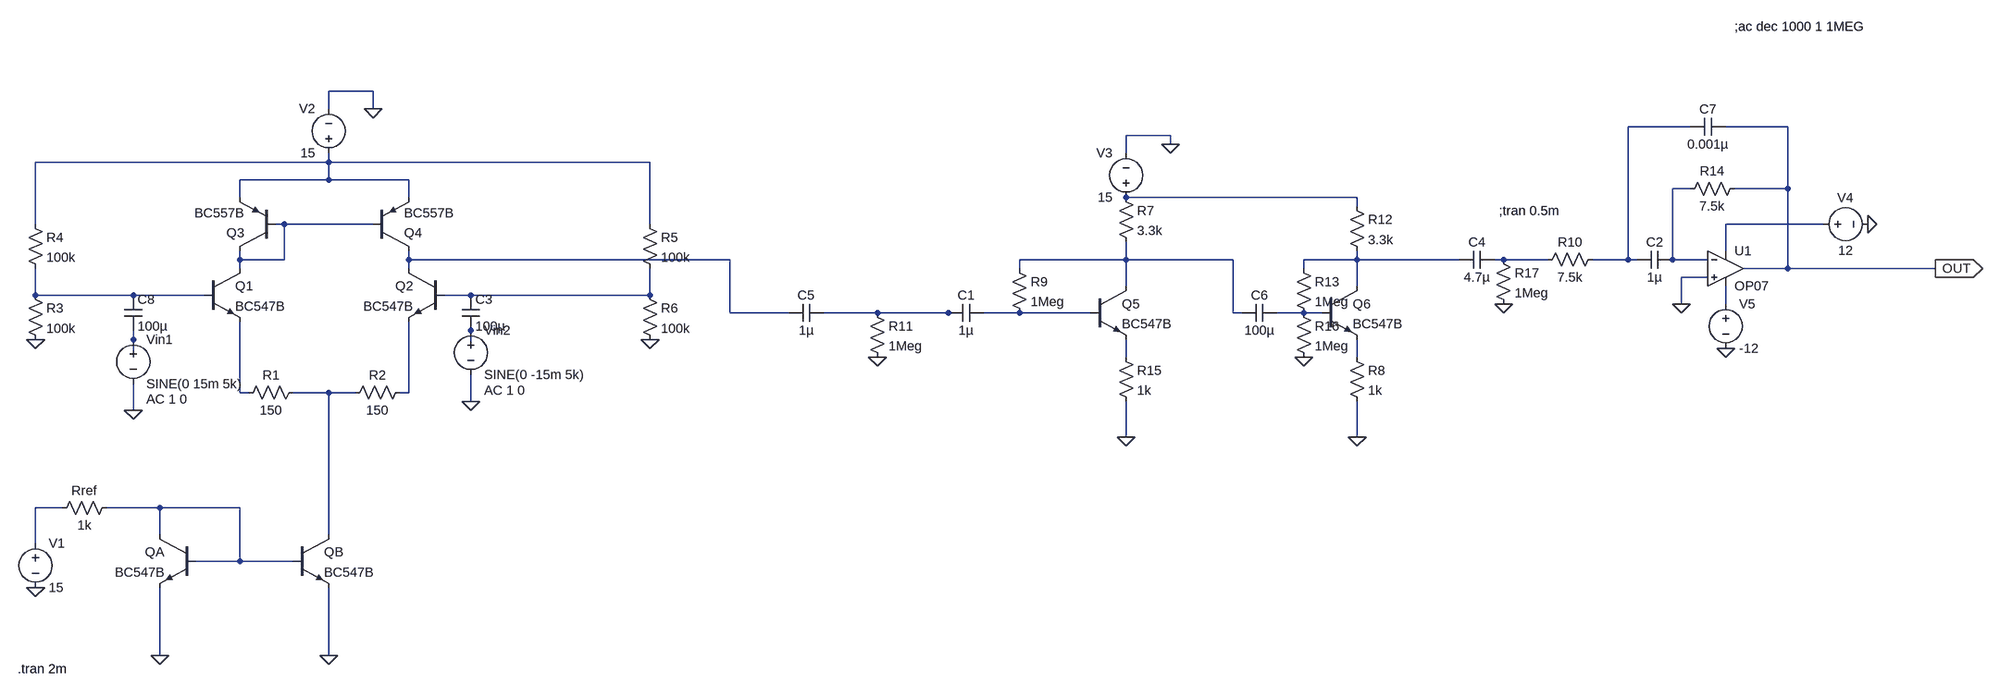
[diagram p0: schematic made by rohan.asc]
made by rohan.asc, the LTspice schematic file:
Version 4
SHEET 1 3628 1044
WIRE 240 -240 160 -240
WIRE 160 -208 160 -240
WIRE 240 -208 240 -240
WIRE 2720 -176 2608 -176
WIRE 2896 -176 2784 -176
WIRE 1776 -160 1696 -160
WIRE 1776 -144 1776 -160
WIRE 1696 -128 1696 -160
WIRE 160 -112 160 -128
WIRE 160 -112 -368 -112
WIRE 752 -112 160 -112
WIRE 160 -80 160 -112
WIRE 160 -80 0 -80
WIRE 304 -80 160 -80
WIRE 2720 -64 2688 -64
WIRE 2896 -64 2896 -176
WIRE 2896 -64 2800 -64
WIRE 0 -48 0 -80
WIRE 304 -48 304 -80
WIRE 2112 -48 1696 -48
WIRE 2112 -32 2112 -48
WIRE -368 0 -368 -112
WIRE 80 0 64 0
WIRE 240 0 80 0
WIRE 752 0 752 -112
WIRE 2960 0 2784 0
WIRE 2784 48 2784 0
WIRE 0 64 0 48
WIRE 80 64 80 0
WIRE 80 64 0 64
WIRE 304 64 304 48
WIRE 896 64 304 64
WIRE 1696 64 1696 32
WIRE 1696 64 1504 64
WIRE 1888 64 1696 64
WIRE 2112 64 2112 48
WIRE 2112 64 2016 64
WIRE 2304 64 2112 64
WIRE 2384 64 2368 64
WIRE 2464 64 2384 64
WIRE 2608 64 2608 -176
WIRE 2608 64 2544 64
WIRE 2624 64 2608 64
WIRE 2688 64 2688 -64
WIRE 2752 64 2688 64
WIRE 0 80 0 64
WIRE 304 80 304 64
WIRE 1504 80 1504 64
WIRE 2016 80 2016 64
WIRE 2896 80 2896 -64
WIRE 2896 80 2816 80
WIRE 3168 80 2896 80
WIRE 2752 96 2704 96
WIRE 1696 112 1696 64
WIRE 2112 112 2112 64
WIRE -368 128 -368 80
WIRE -192 128 -368 128
WIRE -64 128 -192 128
WIRE 416 128 368 128
WIRE 752 128 752 80
WIRE 752 128 416 128
WIRE 2704 144 2704 96
WIRE 2784 144 2784 112
WIRE 896 160 896 64
WIRE 1088 160 896 160
WIRE 1248 160 1152 160
WIRE 1376 160 1248 160
WIRE 1392 160 1376 160
WIRE 1504 160 1440 160
WIRE 1632 160 1504 160
WIRE 1888 160 1888 64
WIRE 1904 160 1888 160
WIRE 2016 160 1968 160
WIRE 2048 160 2016 160
WIRE 416 192 416 176
WIRE -192 208 -192 192
WIRE 416 224 416 192
WIRE -192 240 -192 208
WIRE 1696 240 1696 208
WIRE 2112 240 2112 208
WIRE 0 304 0 176
WIRE 16 304 0 304
WIRE 160 304 96 304
WIRE 208 304 160 304
WIRE 304 304 304 176
WIRE 304 304 288 304
WIRE 416 320 416 272
WIRE -192 336 -192 288
WIRE 1696 384 1696 320
WIRE 2112 384 2112 320
WIRE -320 512 -368 512
WIRE -144 512 -240 512
WIRE 0 512 -144 512
WIRE -144 560 -144 512
WIRE 160 560 160 304
WIRE -368 576 -368 512
WIRE 0 608 0 512
WIRE 0 608 -80 608
WIRE 96 608 0 608
WIRE -144 880 -144 656
WIRE 160 880 160 656
FLAG 240 -208 0
FLAG -144 880 0
FLAG 160 880 0
FLAG -368 656 0
FLAG -368 208 0
FLAG 752 208 0
FLAG 1696 384 0
FLAG 1776 -144 0
FLAG 1248 240 0
FLAG 2112 384 0
FLAG 3168 80 OUT
IOPIN 3168 80 Out
FLAG 3040 0 0
FLAG 2704 144 0
FLAG 2784 224 0
FLAG -192 336 0
FLAG 416 320 0
FLAG 2016 240 0
FLAG 2384 144 0
SYMBOL npn 368 80 M0
SYMATTR InstName Q2
SYMATTR Value BC547B
SYMBOL npn -64 80 R0
SYMATTR InstName Q1
SYMATTR Value BC547B
SYMBOL res 112 288 R90
WINDOW 0 0 56 VBottom 2
WINDOW 3 32 56 VTop 2
SYMATTR InstName R1
SYMATTR Value 150
SYMBOL res 304 288 R90
WINDOW 0 0 56 VBottom 2
WINDOW 3 32 56 VTop 2
SYMATTR InstName R2
SYMATTR Value 150
SYMBOL npn 96 560 R0
SYMATTR InstName QB
SYMATTR Value BC547B
SYMBOL npn -80 560 M0
SYMATTR InstName QA
SYMATTR Value BC547B
SYMBOL res -224 496 R90
WINDOW 0 0 56 VBottom 2
WINDOW 3 32 56 VTop 2
SYMATTR InstName Rref
SYMATTR Value 1k
SYMBOL voltage 160 -112 R180
WINDOW 0 24 96 Left 2
WINDOW 3 24 16 Left 2
WINDOW 123 0 0 Left 0
WINDOW 39 0 0 Left 0
SYMATTR InstName V2
SYMATTR Value 15
SYMBOL pnp 64 48 R180
SYMATTR InstName Q3
SYMATTR Value BC557B
SYMBOL pnp 240 48 M180
SYMATTR InstName Q4
SYMATTR Value BC557B
SYMBOL voltage -368 560 R0
WINDOW 123 0 0 Left 0
WINDOW 39 0 0 Left 0
SYMATTR InstName V1
SYMATTR Value 15
SYMBOL res -384 112 R0
SYMATTR InstName R3
SYMATTR Value 100k
SYMBOL res -384 -16 R0
SYMATTR InstName R4
SYMATTR Value 100k
SYMBOL res 736 -16 R0
SYMATTR InstName R5
SYMATTR Value 100k
SYMBOL res 736 112 R0
SYMATTR InstName R6
SYMATTR Value 100k
SYMBOL npn 1632 112 R0
SYMATTR InstName Q5
SYMATTR Value BC547B
SYMBOL res 1680 -64 R0
SYMATTR InstName R7
SYMATTR Value 3.3k
SYMBOL voltage 1696 -32 R180
WINDOW 0 24 96 Left 2
WINDOW 3 24 16 Left 2
WINDOW 123 0 0 Left 0
WINDOW 39 0 0 Left 0
SYMATTR InstName V3
SYMATTR Value 15
SYMBOL cap 2368 48 R90
WINDOW 0 0 32 VBottom 2
WINDOW 3 32 32 VTop 2
SYMATTR InstName C4
SYMATTR Value 4.7µ
SYMBOL cap 1440 144 R90
WINDOW 0 0 32 VBottom 2
WINDOW 3 32 32 VTop 2
SYMATTR InstName C1
SYMATTR Value 1µ
SYMBOL res 1232 144 R0
SYMATTR InstName R11
SYMATTR Value 1Meg
SYMBOL cap 1152 144 R90
WINDOW 0 0 32 VBottom 2
WINDOW 3 32 32 VTop 2
SYMATTR InstName C5
SYMATTR Value 1µ
SYMBOL npn 2048 112 R0
SYMATTR InstName Q6
SYMATTR Value BC547B
SYMBOL res 2096 224 R0
SYMATTR InstName R8
SYMATTR Value 1k
SYMBOL cap 1968 144 R90
WINDOW 0 0 32 VBottom 2
WINDOW 3 32 32 VTop 2
SYMATTR InstName C6
SYMATTR Value 100µ
SYMBOL res 2096 -48 R0
SYMATTR InstName R12
SYMATTR Value 3.3k
SYMBOL res 1680 224 R0
SYMATTR InstName R15
SYMATTR Value 1k
SYMBOL res 2000 64 R0
SYMATTR InstName R13
SYMATTR Value 1Meg
SYMBOL res 1488 64 R0
SYMATTR InstName R9
SYMATTR Value 1Meg
SYMBOL cap 400 128 R0
SYMATTR InstName C3
SYMATTR Value 100µ
SYMBOL voltage -192 192 R0
WINDOW 123 24 124 Left 2
WINDOW 39 0 0 Left 0
SYMATTR Value2 AC 1 0
SYMATTR InstName Vin1
SYMATTR Value SINE(0 15m 5k)
SYMBOL OpAmps\\OP07 2784 16 R0
SYMATTR InstName U1
SYMBOL res 2560 48 R90
WINDOW 0 0 56 VBottom 2
WINDOW 3 32 56 VTop 2
SYMATTR InstName R10
SYMATTR Value 7.5k
SYMBOL cap 2688 48 R90
WINDOW 0 0 32 VBottom 2
WINDOW 3 32 32 VTop 2
SYMATTR InstName C2
SYMATTR Value 1µ
SYMBOL res 2816 -80 R90
WINDOW 0 0 56 VBottom 2
WINDOW 3 32 56 VTop 2
SYMATTR InstName R14
SYMATTR Value 7.5k
SYMBOL cap 2784 -192 R90
WINDOW 0 0 32 VBottom 2
WINDOW 3 32 32 VTop 2
SYMATTR InstName C7
SYMATTR Value 0.001µ
SYMBOL voltage 2944 0 R270
WINDOW 0 32 56 VTop 2
WINDOW 3 -32 56 VBottom 2
WINDOW 123 0 0 Left 0
WINDOW 39 0 0 Left 0
SYMATTR InstName V4
SYMATTR Value 12
SYMBOL voltage 2784 128 R0
WINDOW 123 0 0 Left 0
WINDOW 39 0 0 Left 0
SYMATTR InstName V5
SYMATTR Value -12
SYMBOL cap -208 128 R0
SYMATTR InstName C8
SYMATTR Value 100µ
SYMBOL voltage 416 176 R0
WINDOW 123 24 124 Left 2
WINDOW 39 0 0 Left 0
SYMATTR Value2 AC 1 0
SYMATTR InstName Vin2
SYMATTR Value SINE(0 -15m 5k)
SYMBOL res 2000 144 R0
SYMATTR InstName R16
SYMATTR Value 1Meg
SYMBOL res 2368 48 R0
SYMATTR InstName R17
SYMATTR Value 1Meg
TEXT -400 904 Left 2 !.tran 2m
TEXT 2800 -432 Left 2 !;ac dec 1000 1 1MEG
TEXT 2376 -24 Left 2 !;tran 0.5m

The netlist it stands for:
* made by rohan.asc
Q2 N007 N012 N023 0 BC547B
Q1 N005 N011 N021 0 BC547B
R1 N022 N021 150
R2 N023 N022 150
QB N022 N025 0 0 BC547B
QA N025 N025 0 0 BC547B
Rref N025 N024 1k
V2 N002 0 15
Q3 N005 N005 N002 0 BC557B
Q4 N007 N005 N002 0 BC557B
V1 N024 0 15
R3 N011 0 100k
R4 N002 N011 100k
R5 N002 N012 100k
R6 N012 0 100k
Q5 N008 N015 N019 0 BC547B
R7 N004 N008 3.3k
V3 N004 0 15
C4 N010 N009 4.7µ
C1 N015 N014 1µ
R11 N014 0 1Meg
C5 N014 N007 1µ
Q6 N009 N016 N020 0 BC547B
R8 N020 0 1k
C6 N016 N008 100µ
R12 N004 N009 3.3k
R15 N019 0 1k
R13 N009 N016 1Meg
R9 N008 N015 1Meg
C3 N012 N017 100µ
Vin1 N018 0 SINE(0 15m 5k) AC 1 0
XU1 0 N003 N006 N013 OUT LT1001  ; OP07, pins In+ In- V+ V- OUT
R10 N001 N010 7.5k
C2 N003 N001 1µ
R14 OUT N003 7.5k
C7 OUT N001 0.001µ
V4 N006 0 12
V5 N013 0 -12
C8 N011 N018 100µ
Vin2 N017 0 SINE(0 -15m 5k) AC 1 0
R16 N016 0 1Meg
R17 N010 0 1Meg
.model NPN NPN
.model PNP PNP
.lib standard.bjt
.tran 2m
;ac dec 1000 1 1MEG
;tran 0.5m
.lib LTC.lib
.backanno
.end